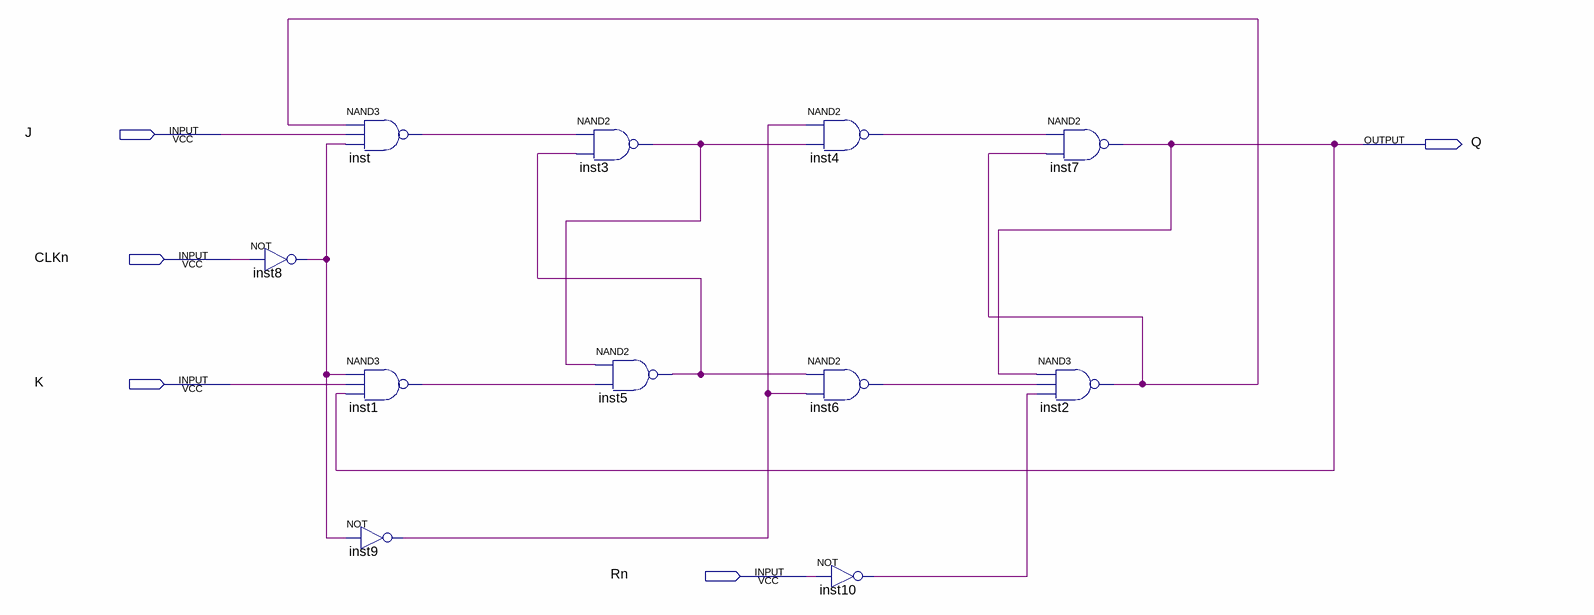
[diagram p0: schematic sheet]
// Quartus schematic FF_JK.bdf as structural Verilog: 11 symbols, 5 pins
module FF_JK (
  input  J,
  input  CLKn,
  input  K,
  input  Rn,
  output Q
);

  wire inst1_out, inst2_out, inst3_out, inst4_out, inst5_out, inst6_out, inst8_out, inst9_out, inst10_out,
       inst_out;

  not inst8 (inst8_out, CLKn);
  nand inst (inst_out, inst2_out, J, inst8_out);
  nand inst1 (inst1_out, inst8_out, K, Q);
  not inst9 (inst9_out, inst8_out);
  nand inst3 (inst3_out, inst_out, inst5_out);
  nand inst5 (inst5_out, inst3_out, inst1_out);
  nand inst4 (inst4_out, inst9_out, inst3_out);
  nand inst6 (inst6_out, inst5_out, inst9_out);
  not inst10 (inst10_out, Rn);
  nand inst7 (Q, inst4_out, inst2_out);
  nand inst2 (inst2_out, Q, inst6_out, inst10_out);
endmodule
